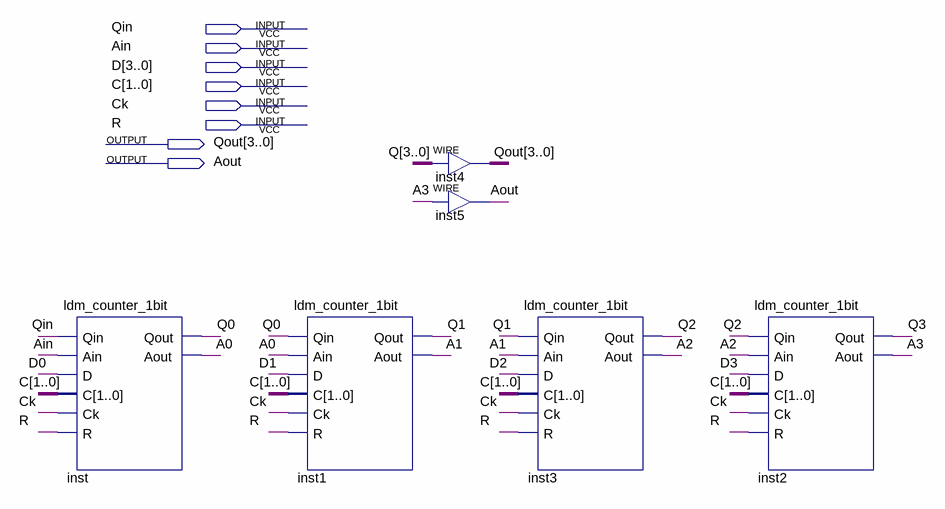
[diagram p0: schematic sheet]
// Quartus schematic ldm_counter_4bits.bdf as structural Verilog: 6 symbols, 8 pins
module ldm_counter_4bits (
  input  Qin,
  input  Ain,
  input  [3:0] D,
  input  [1:0] C,
  input  Ck,
  input  R,
  output [3:0] Qout,
  output Aout
);

  wire A0, A1, A2, A3;
  wire [3:0] Q;

  ldm_counter_1bit inst (.Qin(Qin), .Ain(Ain), .D(D[0]), .C(C), .Ck(Ck), .R(R), .Qout(Q[0]), .Aout(A0));
  ldm_counter_1bit inst1 (.Qin(Q[0]), .Ain(A0), .D(D[1]), .C(C), .Ck(Ck), .R(R), .Qout(Q[1]), .Aout(A1));
  assign Qout = Q;  // WIRE inst4
  assign Aout = A3;  // WIRE inst5
  ldm_counter_1bit inst3 (.Qin(Q[1]), .Ain(A1), .D(D[2]), .C(C), .Ck(Ck), .R(R), .Qout(Q[2]), .Aout(A2));
  ldm_counter_1bit inst2 (.Qin(Q[2]), .Ain(A2), .D(D[3]), .C(C), .Ck(Ck), .R(R), .Qout(Q[3]), .Aout(A3));
endmodule
